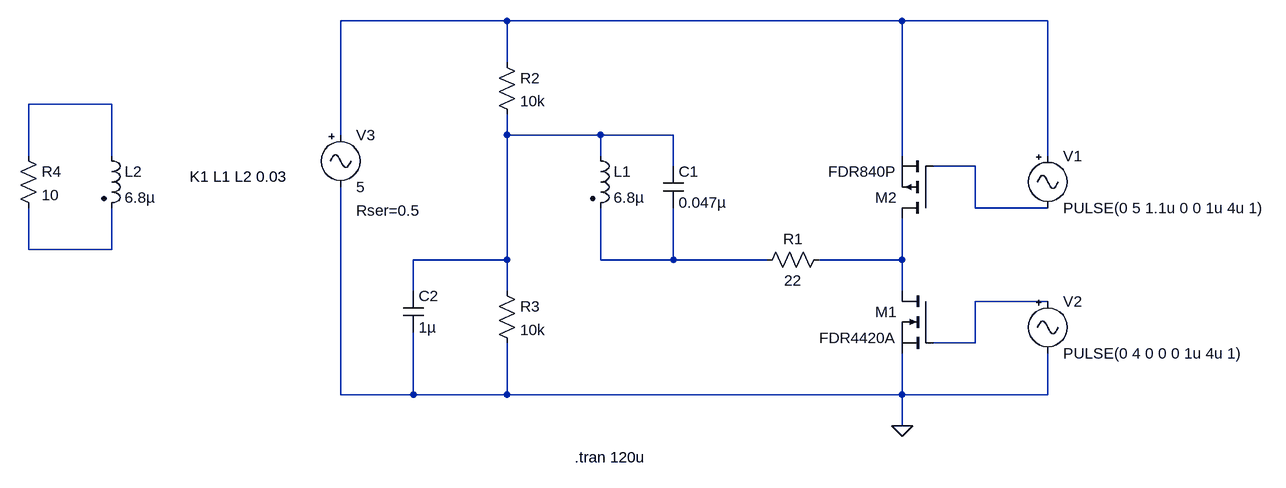
[diagram p0: schematic AlbertSpice.asc]
AlbertSpice.asc, the LTspice schematic file:
Version 4
SHEET 1 880 680
WIRE -416 -240 -672 -240
WIRE 192 -240 -416 -240
WIRE 416 -240 192 -240
WIRE -416 -176 -416 -240
WIRE -1024 -112 -1152 -112
WIRE -672 -64 -672 -240
WIRE -416 -64 -416 -96
WIRE -272 -64 -416 -64
WIRE -160 -64 -272 -64
WIRE -1152 -32 -1152 -112
WIRE -1024 -32 -1024 -112
WIRE -272 -32 -272 -64
WIRE 192 -32 192 -240
WIRE 416 -32 416 -240
WIRE -160 -16 -160 -64
WIRE 304 -16 240 -16
WIRE 304 48 304 -16
WIRE 416 48 304 48
WIRE -1152 112 -1152 48
WIRE -1024 112 -1024 48
WIRE -1024 112 -1152 112
WIRE -416 128 -416 -64
WIRE -416 128 -560 128
WIRE -272 128 -272 48
WIRE -160 128 -160 48
WIRE -160 128 -272 128
WIRE -16 128 -160 128
WIRE 192 128 192 64
WIRE 192 128 64 128
WIRE -560 176 -560 128
WIRE -416 176 -416 128
WIRE 192 176 192 128
WIRE 416 192 304 192
WIRE 304 256 304 192
WIRE 304 256 240 256
WIRE -672 336 -672 16
WIRE -560 336 -560 240
WIRE -560 336 -672 336
WIRE -416 336 -416 256
WIRE -416 336 -560 336
WIRE 192 336 192 272
WIRE 192 336 -416 336
WIRE 416 336 416 272
WIRE 416 336 192 336
WIRE 192 384 192 336
FLAG 192 384 0
SYMBOL nmos 240 176 M0
SYMATTR InstName M1
SYMATTR Value FDR4420A
SYMBOL pmos 240 64 R180
SYMATTR InstName M2
SYMATTR Value FDR840P
SYMBOL Misc\\signal 416 -48 R0
WINDOW 123 0 0 Left 0
WINDOW 39 0 0 Left 0
SYMATTR InstName V1
SYMATTR Value PULSE(0 5 1.1u 0 0 1u 4u 1)
SYMBOL Misc\\signal 416 176 R0
WINDOW 123 0 0 Left 0
WINDOW 39 0 0 Left 0
SYMATTR InstName V2
SYMATTR Value PULSE(0 4 0 0 0 1u 4u 1)
SYMBOL res 80 112 R90
WINDOW 0 0 56 VBottom 2
WINDOW 3 32 56 VTop 2
SYMATTR InstName R1
SYMATTR Value 22
SYMBOL ind2 -288 -48 R0
SYMATTR InstName L1
SYMATTR Value 6.8µ
SYMATTR SpiceLine Ipk=1.8 Rser=0.060 Rpar=9724.7 Cpar=4.998p
SYMATTR Type ind
SYMBOL cap -176 -16 R0
SYMATTR InstName C1
SYMATTR Value 0.047µ
SYMATTR SpiceLine Rser=0.05
SYMBOL res -432 -192 R0
SYMATTR InstName R2
SYMATTR Value 10k
SYMBOL res -432 160 R0
SYMATTR InstName R3
SYMATTR Value 10k
SYMBOL cap -576 176 R0
SYMATTR InstName C2
SYMATTR Value 1µ
SYMBOL Misc\\signal -672 -80 R0
WINDOW 123 0 0 Left 0
WINDOW 39 24 132 Left 2
SYMATTR SpiceLine Rser=0.5
SYMATTR InstName V3
SYMATTR Value 5
SYMBOL ind2 -1040 -48 R0
SYMATTR InstName L2
SYMATTR Value 6.8µ
SYMATTR Type ind
SYMBOL res -1168 -48 R0
SYMATTR InstName R4
SYMATTR Value 10
TEXT -312 432 Left 2 !.tran 120u
TEXT -904 0 Left 2 !K1 L1 L2 0.03

The netlist it stands for:
* AlbertSpice.asc
M1 N007 N008 0 0 FDR4420A
M2 N007 N004 N001 N001 FDR840P
V1 N001 N004 PULSE(0 5 1.1u 0 0 1u 4u 1)
V2 N008 0 PULSE(0 4 0 0 0 1u 4u 1)
R1 N007 N006 22
L1 N003 N006 6.8µ Ipk=1.8 Rser=0.060 Rpar=9724.7 Cpar=4.998p
C1 N003 N006 0.047µ Rser=0.05
R2 N001 N003 10k
R3 N003 0 10k
C2 N003 0 1µ
V3 N001 0 5 Rser=0.5
L2 N002 N005 6.8µ
R4 N002 N005 10
.model NMOS NMOS
.model PMOS PMOS
.lib standard.mos
.tran 120u
K1 L1 L2 0.03
.backanno
.end